# Altium schematic sheet Buck.SchDoc
size A; SheetNumber: 4; SheetTotal: 4
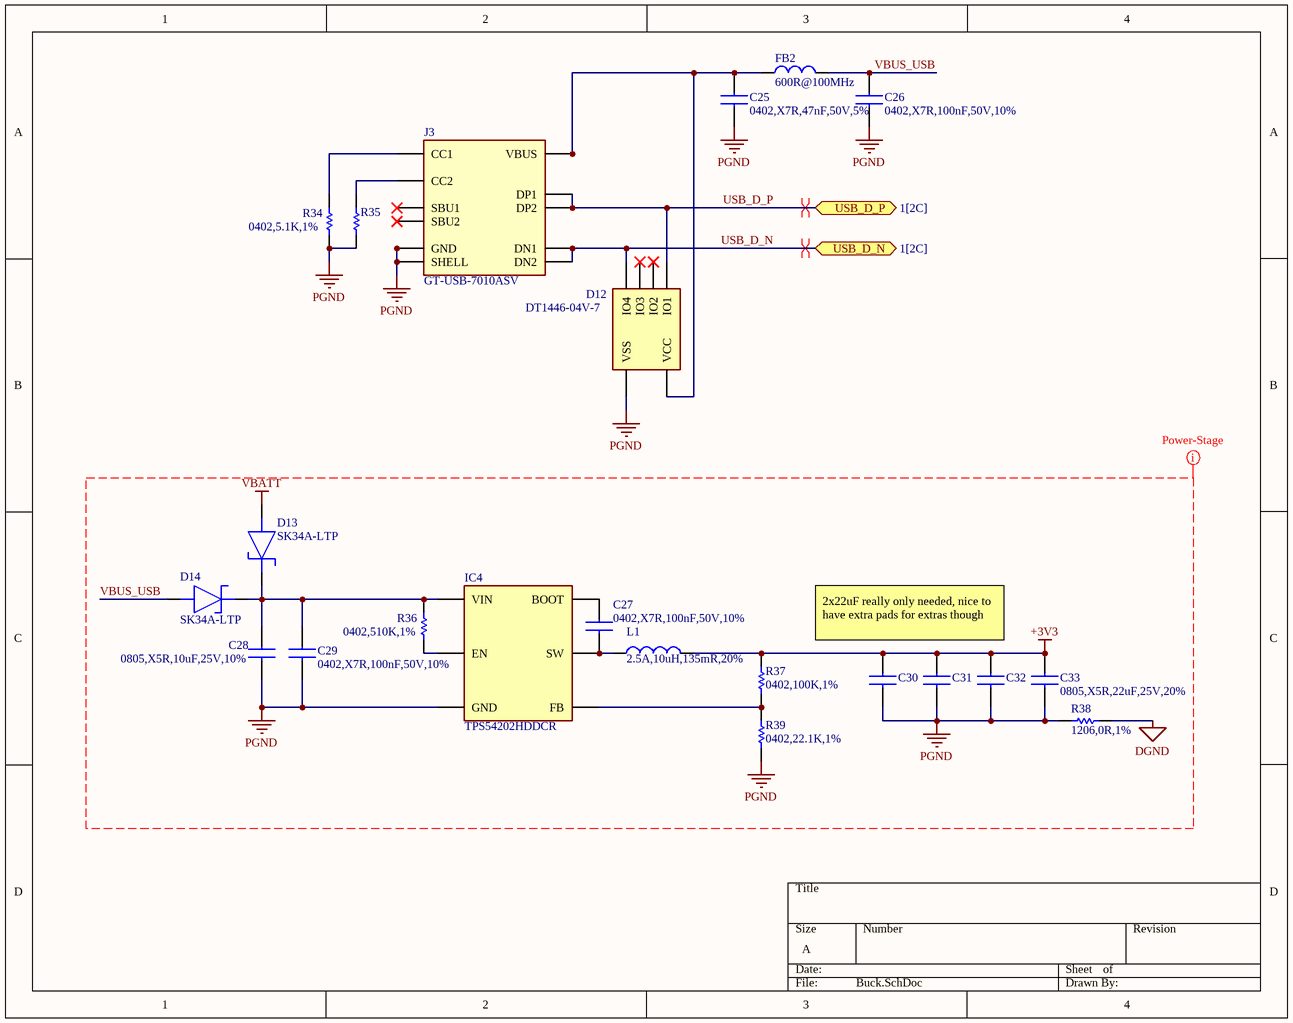
[diagram p0: Buck.SchDoc]

## Parts
C25  0402,X7R,47nF,50V,5%  [CAPC1005X55N]
C26  0402,X7R,100nF,50V,10%  [CAPC1005X55N]
C27  0402,X7R,100nF,50V,10%  [CAPC1005X55N]
C28  0805,X5R,10uF,25V,10%  [CAPC2012X145N]
C29  0402,X7R,100nF,50V,10%  [CAPC1005X55N]
C30  0805,X5R,22uF,25V,20%  [CAPC2012X145N]  (value not drawn)
C31  0805,X5R,22uF,25V,20%  [CAPC2012X145N]  (value not drawn)
C32  0805,X5R,22uF,25V,20%  [CAPC2012X145N]  (value not drawn)
C33  0805,X5R,22uF,25V,20%  [CAPC2012X145N]
D12  DT1446-04V-7  [SOTFL50P162X60-6N]
D13  SK34A-LTP  [SK34ALTP]
D14  SK34A-LTP  [SK34ALTP]
FB2  600R@100MHz  [L0603]
IC4  TPS54202HDDCR  [SOT95P280X100-6N]
J3  GT-USB-7010ASV  [USB-C-SMD_G-SWITCH_GT-USB-7010ASV]
L1  2.5A,10uH,135mR,20%  [IND-SMD_L3.0-W3.0_FTC303020D]
R34  0402,5.1K,1%  [RESC1005X40N]
R35  0402,5.1K,1%  [RESC1005X40N]  (value not drawn)
R36  0402,510K,1%  [RESC1005X40N]
R37  0402,100K,1%  [RESC1005X40N]
R38  1206,0R,1%  [RESC3116X65N]
R39  0402,22.1K,1%  [RESC1005X40N]

## Ports
USB_D_N (bidir, see 1[2C]), USB_D_P (bidir, see 1[2C])

## Nets
+3V3: C30.2 C31.2 C32.2 C33.2 L1.2 R37.2
DGND: R38.2
PGND: C25.1 C26.1 C28.1 C29.1 C30.1 C31.1 C32.1 C33.1 D12.2(VSS) IC4.1(GND) J3.1(SHELL) J3.2(SHELL) J3.3(SHELL) J3.4(SHELL) J3.A1B12(GND) J3.B1A12(GND) R34.1 R35.1 R38.1 R39.1
VBATT: D13.2(A)
USB_D_N: D12.6(IO4) J3.A7(DN1) J3.B7(DN2) ; port USB_D_N
USB_D_P: D12.1(IO1) J3.A6(DP1) J3.B6(DP2) ; port USB_D_P
VBUS_USB: C26.2 D14.2(A) FB2.2
NetC25_2: C25.2 D12.5(VCC) FB2.1 J3.A4B9(VBUS) J3.B4A9(VBUS)
NetC27_1: C27.1 IC4.2(SW) L1.1
NetC27_2: C27.2 IC4.6(BOOT)
NetC28_2: C28.2 C29.2 D13.1(K) D14.1(K) IC4.3(VIN) R36.2
NetIC4_4: IC4.4(FB) R37.1 R39.2
NetIC4_5: IC4.5(EN) R36.1
NetJ3_A5: J3.A5(CC1) R34.2
NetJ3_B5: J3.B5(CC2) R35.2

Not connected (* = marked no-connect by the designer): D12 3(IO2)* 4(IO3)*; J3 A8(SBU1)* B8(SBU2)*

## Layout directives
differential pair: USB_D_N, USB_D_P
CompClassName: Power-Stage: +3V3, DGND, PGND, VBATT, VBUS_USB

## Notes on the sheet
- 2x22uF really only needed, nice to have extra pads for extras though

## Library data of the parts
C25 = CC0402JRX7R9BB473: 0.047 µF ±5% 50V Ceramic Capacitor X7R 0402 (1005 Metric); Manufacturer_Name: YAGEO; Datasheet Link: https://4donline.ihs.com/images/VipMasterIC/IC/YAGO/YAGO-S-A0003557223/YAGO-S-A0003557223-1.pdf?hkey=6D3A4C79FDBF58556ACFDE234799DDF0; Height: 0.55mm; Manufacturer_Part_Number: CC0402JRX7R9BB473; Mouser Part Number: 603-CC402KRX7R9BB104; Mouser Price/Stock: https://www.mouser.co.uk/ProductDetail/YAGEO/CC0402KRX7R9BB104?qs=vRUrOTOuwyGrQb4GbTIVjw%3D%3D; Arrow Part Number: CC0402KRX7R9BB104; Arrow Price/Stock: https://www.arrow.com/en/products/cc0402krx7r9bb104/yageo?utm_currency=USD&region=europe; Manu Part #: CC0402JRX7R9BB473; LCSC Part #: C576715
C26 C27 C29 = CC0402KRX7R9BB104: 0.1 µF ±10% 50V Ceramic Capacitor X7R 0402 (1005 Metric); Manufacturer_Name: YAGEO; Datasheet Link: https://4donline.ihs.com/images/VipMasterIC/IC/YAGO/YAGO-S-A0003557223/YAGO-S-A0003557223-1.pdf?hkey=6D3A4C79FDBF58556ACFDE234799DDF0; Height: 0.55mm; Manufacturer_Part_Number: CC0402KRX7R9BB104; Mouser Part Number: 603-CC402KRX7R9BB104; Mouser Price/Stock: https://www.mouser.co.uk/ProductDetail/YAGEO/CC0402KRX7R9BB104?qs=vRUrOTOuwyGrQb4GbTIVjw%3D%3D; Arrow Part Number: CC0402KRX7R9BB104; Arrow Price/Stock: https://www.arrow.com/en/products/cc0402krx7r9bb104/yageo?utm_currency=USD&region=europe; Manu Part #: CC0402KRX7R9BB104; LCSC Part #: C131394
C28 = CC0805KKX5R8BB106: 10 µF ±10% 25V Ceramic Capacitor X5R 0805 (2012 Metric); Manufacturer_Name: YAGEO; Datasheet Link: https://www.yageo.com/upload/media/product/productsearch/datasheet/mlcc/UPY-GPHC_X5R_4V-to-50V_27.pdf; Height: 1.45mm; Manufacturer_Part_Number: CC0805KKX5R8BB106; Mouser Part Number: 603-CC805KKX5R8BB106; Mouser Price/Stock: https://www.mouser.co.uk/ProductDetail/YAGEO/CC0805KKX5R8BB106?qs=57cj7OiSijm89pM64t1AGQ%3D%3D; Arrow Part Number: CC0805KKX5R8BB106; Arrow Price/Stock: https://www.arrow.com/en/products/cc0805kkx5r8bb106/yageo?utm_currency=USD&region=nac; LCSC Part #: C89831
C30-C33 = CC0805MKX5R8BB226: 25V 22uF X5R ±20% 0805 Ceramic Capacitors RoHS; Manufacturer_Name: YAGEO; Datasheet Link: https://www.yageo.com/upload/media/product/productsearch/datasheet/mlcc/UPY-GPHC_X5R_4V-to-50V_27.pdf; Height: 1.45mm; Manufacturer_Part_Number: CC0805MKX5R8BB226; Mouser Part Number: 603-CC805KKX5R8BB106; Mouser Price/Stock: https://www.mouser.co.uk/ProductDetail/YAGEO/CC0805KKX5R8BB106?qs=57cj7OiSijm89pM64t1AGQ%3D%3D; Arrow Part Number: CC0805KKX5R8BB106; Arrow Price/Stock: https://www.arrow.com/en/products/cc0805kkx5r8bb106/yageo?utm_currency=USD&region=nac; LCSC Part #: C784585
D12 = DT1446-04V-7: 8.5V Clamp 4.7A (8/20µs) Ipp Tvs Diode Surface Mount SOT-563; Manufacturer_Name: Diodes Incorporated; Datasheet Link: https://www.diodes.com//assets/Datasheets/DT1446-04V.pdf; Height: 0.6mm; Manufacturer_Part_Number: DT1446-04V-7; Mouser Part Number: 621-DT1446-04V-7; Mouser Price/Stock: https://www.mouser.co.uk/ProductDetail/Diodes-Incorporated/DT1446-04V-7?qs=5V6w%252Be2aIqaQkUd2yRdmdA%3D%3D; Arrow Part Number: DT1446-04V-7; Arrow Price/Stock: https://www.arrow.com/en/products/dt1446-04v-7/diodes-incorporated; Manu Part #: DT1446-04V-7; LCSC Part #: C460066
D13 D14 = SK34A-LTP: 80A 40V 500mV@3A 3A SMA(DO-214AC) Single Diodes RoHS; Manufacturer_Name: MCC; Datasheet Link: https://mccsemi.com/pdf/Products/SK32A-L-SK310A-L(DO-214AC).pdf; Height: 2.44mm; Manufacturer_Part_Number: SK34A-LTP; Mouser Part Number: 833-SK34A-LTP; Mouser Price/Stock: https://www.mouser.co.uk/ProductDetail/Micro-Commercial-Components-MCC/SK34A-LTP?qs=JeAkOuORR2VPwzg48d%252BVAA%3D%3D; Arrow Part Number: SK34A-LTP; Arrow Price/Stock: https://www.arrow.com/en/products/sk34a-ltp/micro-commercial-components?utm_currency=USD&region=nac; Manu Part #: SK34A-LTP; LCSC Part #: C85269
FB2 = BLM18AG601SN1D: 380mΩ ±25% 600Ω@100MHz 0603 Ferrite Beads ROHS; LCSC Part #: C19330
IC4 = TPS54202HDDCR: 500kHz 2A Buck Adjustable 596mV~28V 1 TSOT-23-6 Voltage Regulators - DC DC Switching Regulators RoHS; Manufacturer_Name: Texas Instruments; Datasheet Link: http://www.ti.com/lit/gpn/tps54202h; Height: 1.1mm; Manufacturer_Part_Number: TPS54202HDDCR; Mouser Part Number: 595-TPS54202HDDCR; Mouser Price/Stock: https://www.mouser.co.uk/ProductDetail/Texas-Instruments/TPS54202HDDCR?qs=uP22XH7NdCtzy%252BOdxI8qhQ%3D%3D; Arrow Part Number: TPS54202HDDCR; Arrow Price/Stock: https://www.arrow.com/en/products/tps54202hddcr/texas-instruments?utm_currency=USD&region=europe; Manu Part #: TPS54202HDDCR; LCSC Part #: C527684
J3 = GT-USB-7010ASV: USB 2.0 3A 1 Surface Mount, Right Angle 16P Female -40℃~+85℃ Type-C SMD USB Connectors ROHS; LCSC Part #: C2988369; Manu Part #: GT-USB-7010ASV
L1 = FTC303020D100MBCA: 2.5A 10uH ±20% 3.8A 135mΩ SMD,3x3mm Fixed Inductors RoHS; Manu Part #: FTC303020D100MBCA; LCSC Part #: C7423323
R34 R35 = RC0402FR-075K1L: 5.1 kOhms ±1% 0.063W, 1/16W Chip Resistor 0402 (1005 Metric) Moisture Resistant Thick Film; Manufacturer_Name: YAGEO; Manufacturer_Part_Number: RC0402FR-0710KL; Datasheet Link: https://componentsearchengine.com/Datasheets/2/RC0402FR-0710KL.pdf; Height: 0.4mm; Mouser Part Number: 603-RC0402FR-0710KL; Mouser Price/Stock: https://www.mouser.co.uk/ProductDetail/YAGEO/RC0402FR-0710KL?qs=I1mnnYJTTsxUoNwrUsQExA%3D%3D; Arrow Part Number: RC0402FR-0710KL; Arrow Price/Stock: https://www.arrow.com/en/products/rc0402fr-0710kl/yageo?region=europe; Manu Part #: RC0402FR-075K1L; LCSC Part #: C105872
R36 = RC0402FR-07510KL: 510 kOhms ±1% 0.063W, 1/16W Chip Resistor 0402 (1005 Metric) Moisture Resistant Thick Film; Manufacturer_Name: YAGEO; Manufacturer_Part_Number: RC0402FR-0710KL; Datasheet Link: https://componentsearchengine.com/Datasheets/2/RC0402FR-0710KL.pdf; Height: 0.4mm; Mouser Part Number: 603-RC0402FR-0710KL; Mouser Price/Stock: https://www.mouser.co.uk/ProductDetail/YAGEO/RC0402FR-0710KL?qs=I1mnnYJTTsxUoNwrUsQExA%3D%3D; Arrow Part Number: RC0402FR-0710KL; Arrow Price/Stock: https://www.arrow.com/en/products/rc0402fr-0710kl/yageo?region=europe; Manu Part #: RC0402FR-07510KL; LCSC Part #: C137961
R37 = RC0402FR-07100KL: 100 kOhms ±1% 0.063W, 1/16W Chip Resistor 0402 (1005 Metric) Moisture Resistant Thick Film; Manufacturer_Name: YAGEO; Manufacturer_Part_Number: RC0402FR-0710KL; Datasheet Link: https://componentsearchengine.com/Datasheets/2/RC0402FR-0710KL.pdf; Height: 0.4mm; Mouser Part Number: 603-RC0402FR-0710KL; Mouser Price/Stock: https://www.mouser.co.uk/ProductDetail/YAGEO/RC0402FR-0710KL?qs=I1mnnYJTTsxUoNwrUsQExA%3D%3D; Arrow Part Number: RC0402FR-0710KL; Arrow Price/Stock: https://www.arrow.com/en/products/rc0402fr-0710kl/yageo?region=europe; Manu Part #: RC0402FR-07100KL; LCSC Part #: C60491
R38 = RC1206FR-070RL: 0Ω 250mW 200V Thick Film Resistor ±1% 1206 Chip Resistor - Surface Mount RoHS; Manufacturer_Name: YAGEO; Datasheet Link: https://www.yageogroup.com/content/datasheet/asset/file/PYU-RC_GROUP_51_ROHS_L; Height: 0.65mm; Manufacturer_Part_Number: RC1206FR-070RL; Mouser Part Number: 603-RC1206FR-070RL; Mouser Price/Stock: https://www.mouser.co.uk/ProductDetail/YAGEO/RC1206FR-070RL?qs=%2FbpERZPLKKvgeF8VBtNQLg%3D%3D; Arrow Part Number: RC1206FR-070RL; Arrow Price/Stock: https://www.arrow.com/en/products/rc1206fr-070rl/yageo?region=nac; Manu Part #: RC1206FR-070RL; LCSC Part #: C137394
R39 = RC0402FR-0722K1L: 22.1 kOhms ±1% 0.063W, 1/16W Chip Resistor 0402 (1005 Metric) Moisture Resistant Thick Film; Manufacturer_Name: YAGEO; Manufacturer_Part_Number: RC0402FR-0710KL; Datasheet Link: https://componentsearchengine.com/Datasheets/2/RC0402FR-0710KL.pdf; Height: 0.4mm; Mouser Part Number: 603-RC0402FR-0710KL; Mouser Price/Stock: https://www.mouser.co.uk/ProductDetail/YAGEO/RC0402FR-0710KL?qs=I1mnnYJTTsxUoNwrUsQExA%3D%3D; Arrow Part Number: RC0402FR-0710KL; Arrow Price/Stock: https://www.arrow.com/en/products/rc0402fr-0710kl/yageo?region=europe; Manu Part #: RC0402FR-0722K1L; LCSC Part #: C163478